# Altium project ESP32_C3.PrjPcb
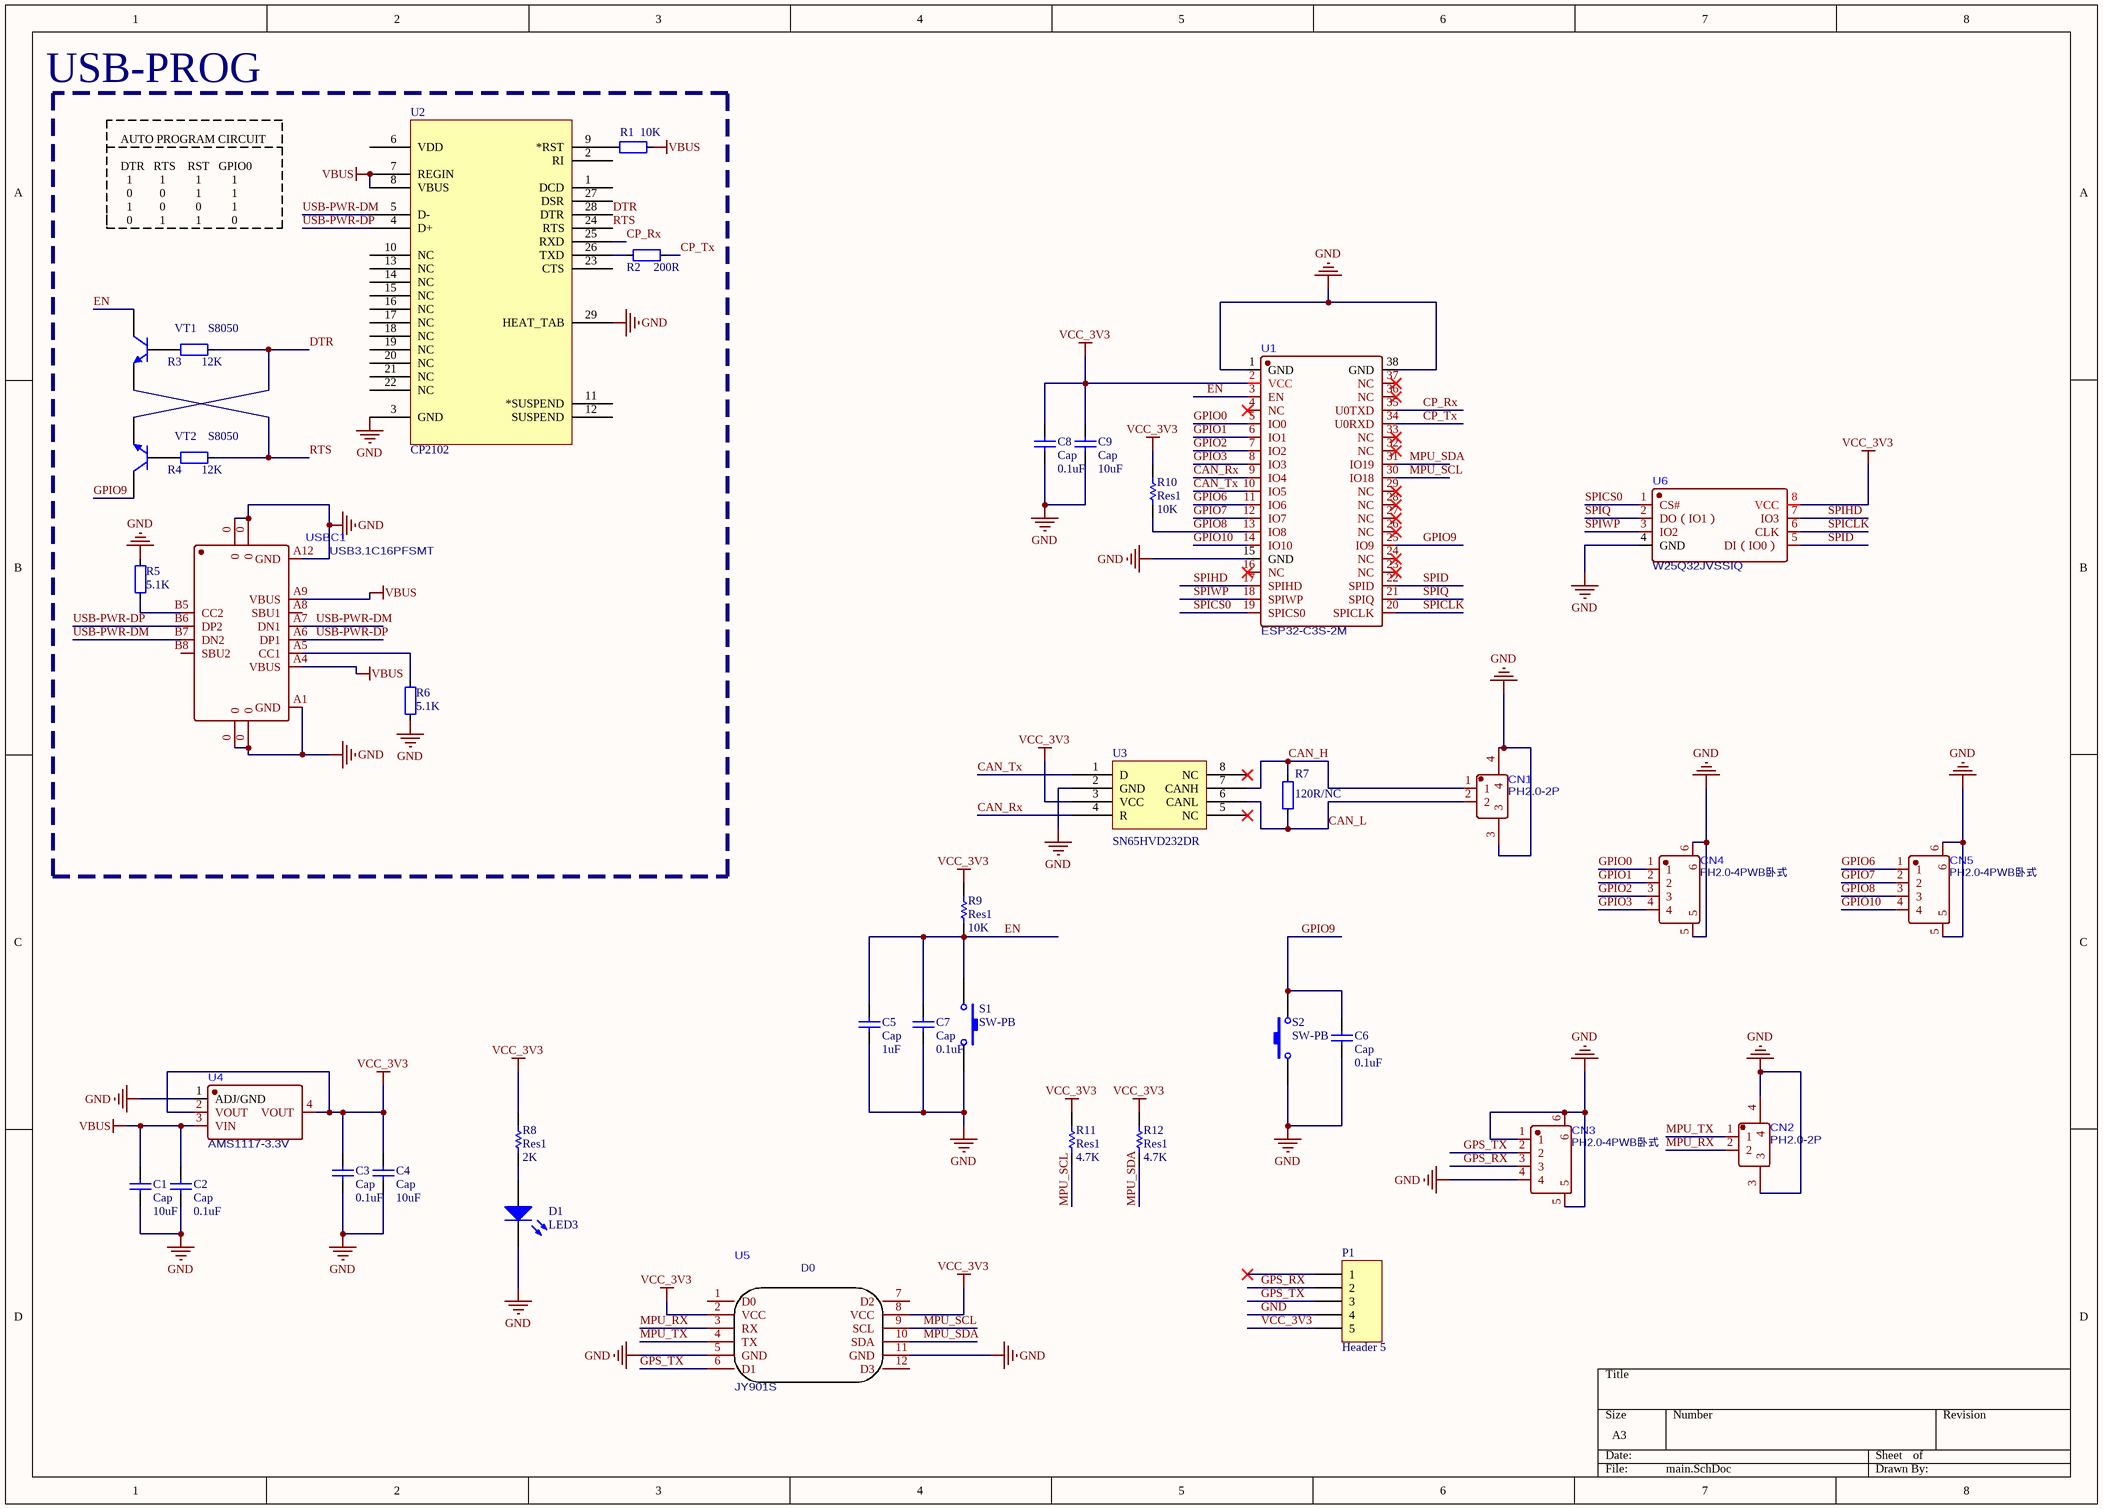
[diagram p0: main.SchDoc]
1 sheet, 39 parts. Net scope: global (net labels, ports and power ports of the same name join across sheets).
Board file: ESP32_C3.PcbDoc

## Sheet main.SchDoc
size A3

### Parts
C1  Cap  value 10uF  [R0603]
C2  Cap  value 0.1uF  [R0603]
C3  Cap  value 0.1uF  [R0603]
C4  Cap  value 10uF  [R0603]
C5  Cap  value 1uF  [R0603]
C6  Cap  value 0.1uF  [R0603]
C7  Cap  value 0.1uF  [R0603]
C8  Cap  value 0.1uF  [R0603]
C9  Cap  value 10uF  [R0603]
CN1  PH2.0-2P  [CONN-SMD_PH2.0-1X2PW]
CN2  PH2.0-2P  [CONN-SMD_PH2.0-1X2PW]
CN3  PH2.0-4PWB卧式  [CONN-SMD_PH2.0-4PWB]
CN4  PH2.0-4PWB卧式  [CONN-SMD_PH2.0-4PWB]
CN5  PH2.0-4PWB卧式  [CONN-SMD_PH2.0-4PWB]
D1  LED3  [R0603]
P1  Header 5  [HDR1X5]
R1  10K  [R0603]
R2  200R  [R0603]
R3  12K  [R0603]
R4  12K  [R0603]
R5  5.1K  [R0603]
R6  5.1K  [R0603]
R7  120R/NC  [R0603]
R8  Res1  value 2K  [R0603]
R9  Res1  value 10K  [R0603]
R10  Res1  value 10K  [R0603]
R11  Res1  value 4.7K  [R0603]
R12  Res1  value 4.7K  [R0603]
S1  SW-PB  [SW-SMD_L6.1-W3.6-LS7.1]
S2  SW-PB  [SW-SMD_L6.1-W3.6-LS7.1]
U1  ESP32-C3S-2M  [WIFIM-SMD_ESP32-C3S-2M]
U2  CP2102  [QFN-28_L5.0-W5.0-P0.50-BL-EP]
U3  Manufacturer Part Number: SN65HVD232DR  [SOIC-8_L5.0-W4.0-P1.27-LS6.0-BL]  (hidden comment: SN65HVD232D)
U4  AMS1117-3.3V  [SOT-223-4_L6.5-W3.5-P2.30-LS7.0-BR]
U5  JY901S  [JY901S-15.24*15.24]
U6  W25Q32JVSSIQ  [SOIC-8_L5.3-W5.3-P1.27-LS8.0-BL]
USBC1  USB3.1C16PFSMT  [USB-C-SMD_TYPE-C-USB-17]
VT1  S8050  [SOT-23-3_L2.9-W1.3-P1.90-LS2.4-BR]
VT2  S8050  [SOT-23-3_L2.9-W1.3-P1.90-LS2.4-BR]

### Nets
GND: C1.1 C2.1 C3.1 C4.1 C5.1 C6.1 C7.1 C8.1 C9.1 CN1.3 CN1.4 CN2.3 CN2.4 CN3.1 CN3.4 CN3.5 CN3.6 CN4.5 CN4.6 CN5.5 CN5.6 D1.2(K) P1.4 R5.1 R6.1 S1.2 S2.1 U1.1(GND) U1.15(GND) U1.38(GND) U2.3(GND) U2.29(HEAT_TAB) U3.2(GND) U4.1(ADJ/GND) U5.5(GND) U5.11(GND) U6.4(GND) USBC1.0 USBC1.A1(GND) USBC1.A12(GND)
VBUS: C1.2 C2.2 R1.1 U2.7(REGIN) U2.8(VBUS) U4.3(VIN) USBC1.A4(VBUS) USBC1.A9(VBUS)
VCC_3V3: C3.2 C4.2 C8.2 C9.2 P1.5 R8.2 R9.2 R10.2 R11.2 R12.2 U1.2(VCC) U3.3(VCC) U4.2(VOUT) U4.4(VOUT) U5.2(VCC) U5.8(VCC) U6.8(VCC)
CAN_H: CN1.1 R7.1 U3.7(CANH)
CAN_L: CN1.2 R7.2 U3.6(CANL)
CAN_Rx: U1.9(IO4) U3.4(R)
CAN_Tx: U1.10(IO5) U3.1(D)
CP_Rx: U1.35(U0TXD) U2.25(RXD)
CP_Tx: R2.1 U1.34(U0RXD)
DTR: R3.1 U2.28(DTR) VT2.2(E)
EN: C5.2 C7.2 R9.1 S1.1 U1.3(EN) VT1.3(C)
GPIO0: CN4.1 U1.5(IO0)
GPIO1: CN4.2 U1.6(IO1)
GPIO2: CN4.3 U1.7(IO2)
GPIO3: CN4.4 U1.8(IO3)
GPIO6: CN5.1 U1.11(IO6)
GPIO7: CN5.2 U1.12(IO7)
GPIO8: CN5.3 R10.1 U1.13(IO8)
GPIO9: C6.2 S2.2 U1.25(IO9) VT2.3(C)
GPIO10: CN5.4 U1.14(IO10)
GPS_RX: CN3.3 P1.2
GPS_TX: CN3.2 P1.3 U5.6(D1)
MPU_RX: CN2.2 U5.3(RX)
MPU_SCL: R11.1 U1.30(IO18) U5.9(SCL)
MPU_SDA: R12.1 U1.31(IO19) U5.10(SDA)
MPU_TX: CN2.1 U5.4(TX)
RTS: R4.1 U2.24(RTS) VT1.2(E)
SPICLK: U1.20(SPICLK) U6.6(CLK)
SPICS0: U1.19(SPICS0) U6.1(CS#)
SPID: U1.22(SPID) U6.5(DI（IO0）)
SPIHD: U1.17(SPIHD) U6.7(IO3)
SPIQ: U1.21(SPIQ) U6.2(DO（IO1）)
SPIWP: U1.18(SPIWP) U6.3(IO2)
USB-PWR-DM: U2.5(D-) USBC1.A7(DN1) USBC1.B7(DN2)
USB-PWR-DP: U2.4(D+) USBC1.A6(DP1) USBC1.B6(DP2)
NetD1_1: D1.1(A) R8.1
NetR1_2: R1.2 U2.9(*RST)
NetR2_2: R2.2 U2.26(TXD)
NetR3_2: R3.2 VT1.1(B)
NetR4_2: R4.2 VT2.1(B)
NetR5_2: R5.2 USBC1.B5(CC2)
NetR6_2: R6.2 USBC1.A5(CC1)

Not connected (* = marked no-connect by the designer): P1 1*; U1 4(NC)* 16(NC)* 23(NC)* 24(NC)* 26(NC)* 27(NC)* 28(NC)* 29(NC)* 32(NC)* 33(NC)* 36(NC)* 37(NC)*; U2 1(DCD) 2(RI) 6(VDD) 10(NC) 11(*SUSPEND) 12(SUSPEND) 13(NC) 14(NC) 15(NC) 16(NC) 17(NC) 18(NC) 19(NC) 20(NC) 21(NC) 22(NC) 23(CTS) 27(DSR); U3 5(NC)* 8(NC)*; U5 1(D0) 7(D2) 12(D3); USBC1 A8(SBU1) B8(SBU2)

### Notes on the sheet
- USB-PROG
- AUTO PROGRAM CIRCUIT
  DTR   RTS    RST   GPIO0
  1         1          1          1
  0         0          1          1
  1         0          0          1
  0         1          1          0

### Library data of the parts
C1-C9 = Cap: Capacitor; Published: 8-Jun-2000; LatestRevisionDate: 17-Jul-2002; LatestRevisionNote: Re-released for DXP Platform.; PackageReference: RAD-0.3; Publisher: Altium Limited; PackageDescription: Radial Cap, Thru-Hole; 2 Leads; 0.3 in Pin Spacing
D1 = LED3: Typical BLUE SiC LED; Published: 8-Jun-2000; LatestRevisionDate: 17-Dec-2003; LatestRevisionNote: PCB Footprint replaced.; DatasheetVersion: 16-Apr-2002; PackageVersion: 16-Apr-2002; PackageReference: 3.5X2.8X1.9; Publisher: Altium Limited; PackageDescription: SM LED; 2 C-Bend Leads; Body 3.5 x 2.8 x 1.9 mm, inc leads (LxWxH typ)
P1 = Header 5: Header, 5-Pin; LatestRevisionDate: 17-Jul-2002; LatestRevisionNote: Re-released for DXP Platform.; Publisher: Altium Limited
R1-R7 = 电阻-0402: Resistor; Value: 22R
R8-R12 = Res1: Resistor; Published: 8-Jun-2000; LatestRevisionDate: 17-Jul-2002; LatestRevisionNote: Re-released for DXP Platform.; PackageReference: AXIAL-0.3; Publisher: Altium Limited; PackageDescription: Axial Device, Thru-Hole; 2 Leads; 0.3 in Pin Spacing
S1 S2 = SW-PB: Switch; Published: 24-Mar-1999; LatestRevisionDate: 17-Jul-2002; LatestRevisionNote: Re-released for DXP Platform.; PackageReference: SPST-2; Publisher: Altium Limited; PackageDescription: Switch; 2 Leads
U2 = CP2102: USB转TTL; PART DESC: SINGLE-CHIP USB TO UART BRIDGE, QFN28, RoHS.; MFG #1: SILICON LABS; PART NUMBER: CP2102; Value: Value; RefDes: RefDes; Type: DEV
U3 = SN65HVD232D: Manufacturer: Texas Instruments; Protocol: CAN; Number of Drivers/Receivers: 1/1; Duplex: Half; Data Rate: 1Mbps; Voltage - Supply: 3 V ~ 3.6 V; Supplier 1: Digi-Key; Supplier Part Number 1: 296-26344-2-ND; RoHS: RoHS Compliant; Category: Integrated Circuits (ICs); Stock: 5000; Pricing 1: 2500=0.84375 (USD); Packaging: Tape & Reel (TR); Part Status: Active; Type: Transceiver; Operating Temperature: -40°C ~ 85°C; Mounting Type: Surface Mount; Package / Case: 8-SOIC (0.154", 3.90mm Width); Supplier Device Package: 8-SOIC; ComponentLink1URL: http://www.ti.com/lit/ds/symlink/sn65hvd230.pdf; ComponentLink1Description: http://www.ti.com/lit/ds/symlink/sn65hvd230.pdf; Supplier 2: Digi-Key; Supplier Part Number 2: 296-26344-1-ND; Pricing 2: 1=2.05, 10=1.842, 100=1.4809, 500=1.21668, 1000=1.00811 (USD)
VT1 VT2 = SMT_TRIODE_NPN: Surface mount NPN transistor, package SOT-23